# Altium schematic sheet mbed-enablement-platform_F_1.SchDoc: Mbed EP - ODIN W262 Module
size A4; Date: 10/26/2017 12:01:19 PM; Revision: Firefly; SheetNumber: 1; SheetTotal: 4
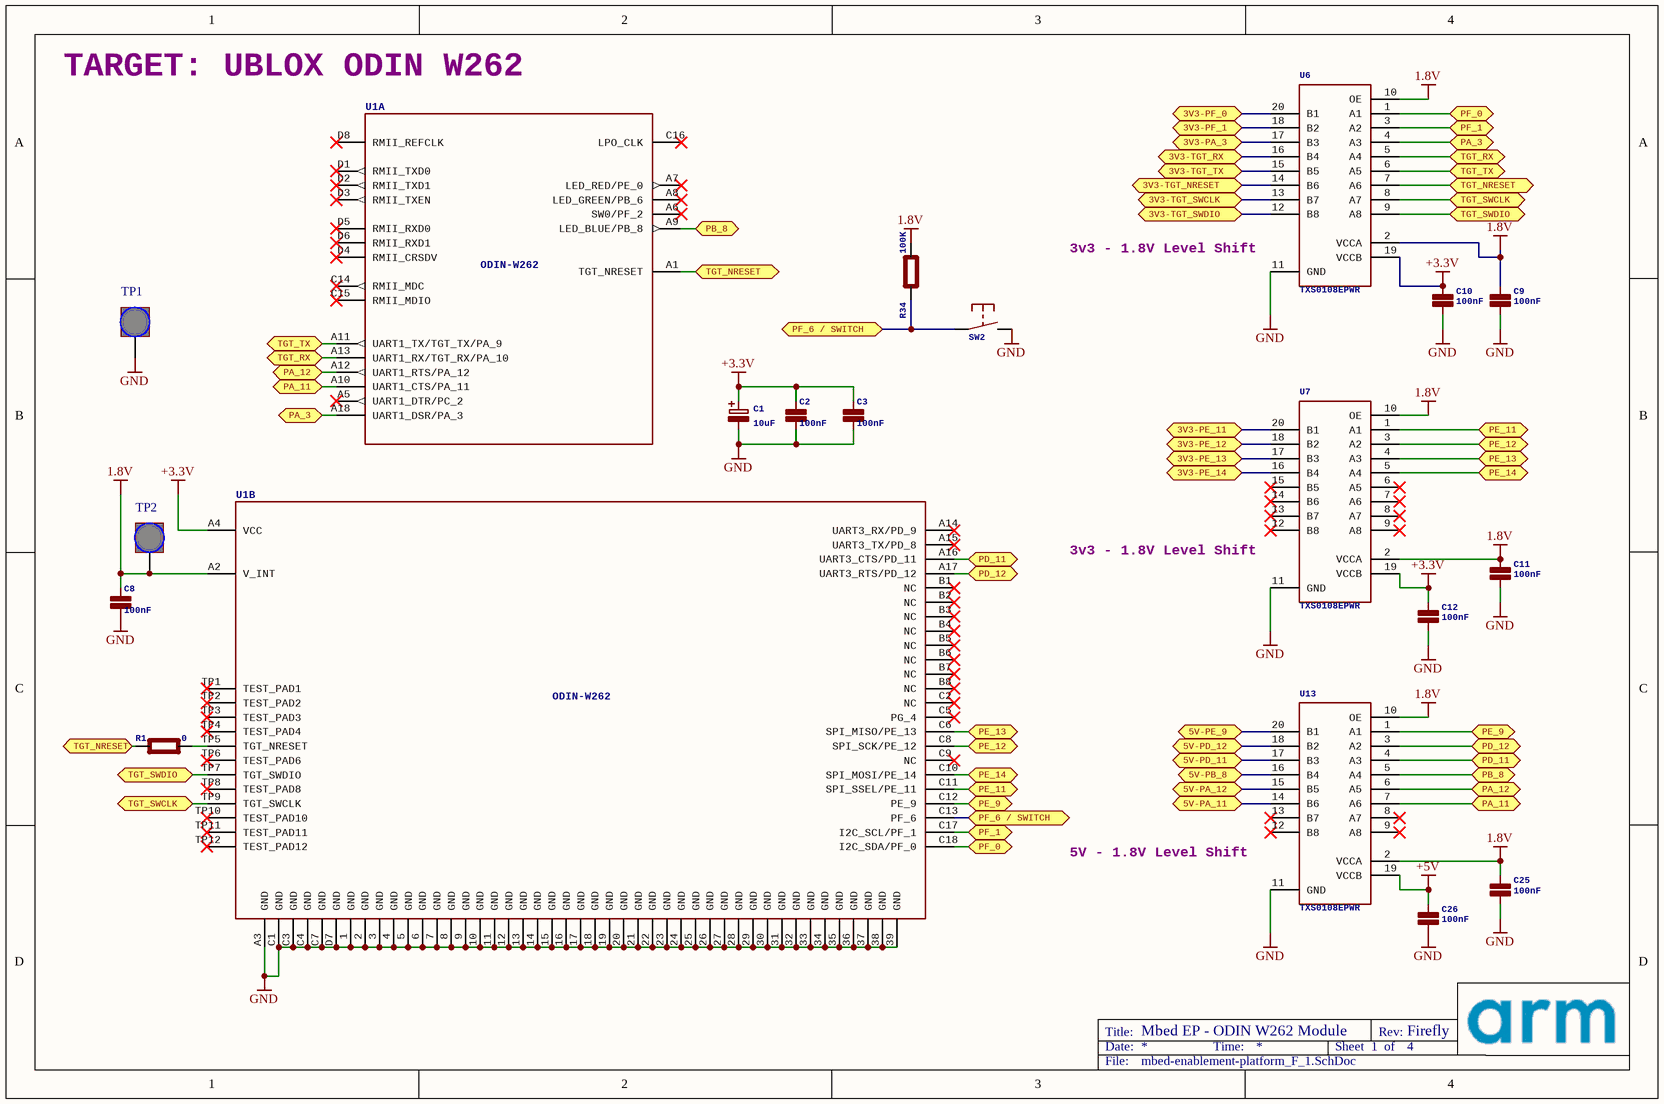
[diagram p0: mbed-enablement-platform_F_1.SchDoc]

## Parts
C1  10uF  [SMC_B]
C2  100nF  [0603]
C3  100nF  [0603]
C8  100nF  [0603]
C9  100nF  [0603]
C10  100nF  [0603]
C11  100nF  [0603]
C12  100nF  [0603]
C25  100nF  [0603]
C26  100nF  [0603]
R1  0  [0402]
R34  100K  [0402]
SW2  MOMENTARY SWITCH RA (SPST)  [EVQ-PF006K]  (value not drawn)
TP1  TP, 1.5mm  [TP1.5]  (value not drawn)
TP2  TP, 1.5mm  [TP1.5]  (value not drawn)
U1  ODIN-W262  [ODIN-88]  (parts A,B of 2)
U6  TXS0108EPWR  [TSSOP-20]
U7  TXS0108EPWR  [TSSOP-20]
U13  TXS0108EPWR  [TSSOP-20]

## Ports
3V3-PA_3, 3V3-PE_11, 3V3-PE_12, 3V3-PE_13, 3V3-PE_14, 3V3-PF_0, 3V3-PF_1, 3V3-TGT_NRESET, 3V3-TGT_RX, 3V3-TGT_SWCLK, 3V3-TGT_SWDIO, 3V3-TGT_TX, 5V-PA_11, 5V-PA_12, 5V-PB_8, 5V-PD_11, 5V-PD_12, 5V-PE_9, PA_3, PA_11, PA_12, PB_8, PD_11, PD_12, PE_9, PE_11, PE_12, PE_13, PE_14, PF_0, PF_1, PF_6 / SWITCH, TGT_NRESET, TGT_RX, TGT_SWCLK, TGT_SWDIO, TGT_TX

## Nets
1.8V: C8.1(P$1) C9.1(P$1) C11.1(P$1) C25.1(P$1) R34.2(P$2) TP2.1 U1.A2(V_INT) U6.2(VCCA) U6.10(OE) U7.2(VCCA) U7.10(OE) U13.2(VCCA) U13.10(OE)
+3.3V: C1.+ C2.1(P$1) C3.1(P$1) C10.1(P$1) C12.1(P$1) U1.A4(VCC) U6.19(VCCB) U7.19(VCCB)
+5V: C26.1(P$1) U13.19(VCCB)
GND: C1.- C2.2(P$2) C3.2(P$2) C8.2(P$2) C9.2(P$2) C10.2(P$2) C11.2(P$2) C12.2(P$2) C25.2(P$2) C26.2(P$2) SW2.2 TP1.1 U1.1(GND) U1.2(GND) U1.3(GND) U1.4(GND) U1.5(GND) U1.6(GND) U1.7(GND) U1.8(GND) U1.9(GND) U1.10(GND) U1.11(GND) U1.12(GND) U1.13(GND) U1.14(GND) U1.15(GND) U1.16(GND) U1.17(GND) U1.18(GND) U1.19(GND) U1.20(GND) U1.21(GND) U1.22(GND) U1.23(GND) U1.24(GND) U1.25(GND) U1.26(GND) U1.27(GND) U1.28(GND) U1.29(GND) U1.30(GND) U1.31(GND) U1.32(GND) U1.33(GND) U1.34(GND) U1.35(GND) U1.36(GND) U1.37(GND) U1.38(GND) U1.39(GND) U1.A3(GND) U1.C1(GND) U1.C3(GND) U1.C4(GND) U1.C7(GND) U1.D7(GND) U6.11(GND) U7.11(GND) U13.11(GND)
3V3-PA_3: U6.17(B3) ; port 3V3-PA_3
3V3-PE_11: U7.20(B1) ; port 3V3-PE_11
3V3-PE_12: U7.18(B2) ; port 3V3-PE_12
3V3-PE_13: U7.17(B3) ; port 3V3-PE_13
3V3-PE_14: U7.16(B4) ; port 3V3-PE_14
3V3-PF_0: U6.20(B1) ; port 3V3-PF_0
3V3-PF_1: U6.18(B2) ; port 3V3-PF_1
3V3-TGT_NRESET: U6.14(B6) ; port 3V3-TGT_NRESET
3V3-TGT_RX: U6.16(B4) ; port 3V3-TGT_RX
3V3-TGT_SWCLK: U6.13(B7) ; port 3V3-TGT_SWCLK
3V3-TGT_SWDIO: U6.12(B8) ; port 3V3-TGT_SWDIO
3V3-TGT_TX: U6.15(B5) ; port 3V3-TGT_TX
5V-PA_11: U13.14(B6) ; port 5V-PA_11
5V-PA_12: U13.15(B5) ; port 5V-PA_12
5V-PB_8: U13.16(B4) ; port 5V-PB_8
5V-PD_11: U13.17(B3) ; port 5V-PD_11
5V-PD_12: U13.18(B2) ; port 5V-PD_12
5V-PE_9: U13.20(B1) ; port 5V-PE_9
PA_3: U1.A18(UART1_DSR/PA_3) U6.4(A3) ; port PA_3
PA_11: U1.A10(UART1_CTS/PA_11) U13.7(A6) ; port PA_11
PA_12: U1.A12(UART1_RTS/PA_12) U13.6(A5) ; port PA_12
PB_8: U1.A9(LED_BLUE/PB_8) U13.5(A4) ; port PB_8
PD_11: U1.A16(UART3_CTS/PD_11) U13.4(A3) ; port PD_11
PD_12: U1.A17(UART3_RTS/PD_12) U13.3(A2) ; port PD_12
PE_9: U1.C12(PE_9) U13.1(A1) ; port PE_9
PE_11: U1.C11(SPI_SSEL/PE_11) U7.1(A1) ; port PE_11
PE_12: U1.C8(SPI_SCK/PE_12) U7.3(A2) ; port PE_12
PE_13: U1.C6(SPI_MISO/PE_13) U7.4(A3) ; port PE_13
PE_14: U1.C10(SPI_MOSI/PE_14) U7.5(A4) ; port PE_14
PF_0: U1.C18(I2C_SDA/PF_0) U6.1(A1) ; port PF_0
PF_1: U1.C17(I2C_SCL/PF_1) U6.3(A2) ; port PF_1
PF_6 / SWITCH: R34.1(P$1) SW2.1 U1.C13(PF_6) ; port PF_6 / SWITCH
TGT_NRESET: R1.1(P$1) U1.A1(TGT_NRESET) U6.7(A6) ; port TGT_NRESET
TGT_RX: U1.A13(UART1_RX/TGT_RX/PA_10) U6.5(A4) ; port TGT_RX
TGT_SWCLK: U1.TP9(TGT_SWCLK) U6.8(A7) ; port TGT_SWCLK
TGT_SWDIO: U1.TP7(TGT_SWDIO) U6.9(A8) ; port TGT_SWDIO
TGT_TX: U1.A11(UART1_TX/TGT_TX/PA_9) U6.6(A5) ; port TGT_TX
NetR1_2: R1.2(P$2) U1.TP5(TGT_NRESET)

Not connected (* = marked no-connect by the designer): U1 A5(UART1_DTR/PC_2)* A6(SW0/PF_2)* A7(LED_RED/PE_0)* A8(LED_GREEN/PB_6)* A14(UART3_RX/PD_9)* A15(UART3_TX/PD_8)* B1(NC)* B2(NC)* B3(NC)* B4(NC)* B5(NC)* B6(NC)* B7(NC)* B8(NC)* C2(NC)* C5(PG_4)* C9(NC)* C14(RMII_MDC)* C15(RMII_MDIO)* C16(LPO_CLK)* D1(RMII_TXD0)* D2(RMII_TXD1)* D3(RMII_TXEN)* D4(RMII_CRSDV)* D5(RMII_RXD0)* D6(RMII_RXD1)* D8(RMII_REFCLK)* TP1(TEST_PAD1)* TP2(TEST_PAD2)* TP3(TEST_PAD3)* TP4(TEST_PAD4)* TP6(TEST_PAD6)* TP8(TEST_PAD8)* TP10(TEST_PAD10)* TP11(TEST_PAD11)* TP12(TEST_PAD12)*; U7 6(A5)* 7(A6)* 8(A7)* 9(A8)* 12(B8)* 13(B7)* 14(B6)* 15(B5)*; U13 8(A7)* 9(A8)* 12(B8)* 13(B7)*

## Notes on the sheet
- TARGET: UBLOX ODIN W262
- 3v3 - 1.8V Level Shift
- 5V - 1.8V Level Shift
- Title:
- Date:
- Time:
- Sheet
- Rev:
- of
- File:

## Library data of the parts
C1 = CAPACITOR-POLARISEDB: Polarised capacitor; MF: Kemet; MFN: T491B106K020AT; OC-DIGIKEY: 399-8298-1-ND; OC-MOUSER: 80-T491B106K020; OC-NEWARK: 57K1740
C2 C3 C8-C12 C25 C26 = CAPACITOR0603: Capacitor
R1 R34 = RESISTOR0402: Resistor
SW2 = EVQ-PF006K: MF: Panasonic; MFN: EVQ-PF006K
TP1 TP2 = TP1.5: 1.5mm round test point
U1 = ODIN-W262: ODIN-W260: Host-based multiradio module with Wi-Fi and Bluetooth, internal antenna   u-blox.com
U6 U7 U13 = TXS0108EPWR: 8-Bit Bi-directional, Level-Shifting, Voltage Translator; MF: Texas Instruments; MFN: TXS0108EPWR; OC-DIGIKEY: 296-23011-1-ND; OC-MOUSER: 595-TXS0108EPWR; OC-NEWARK: 05R8300